# EAGLE design IO4-Codeline-Matrix (EAGLE 7.7.0)
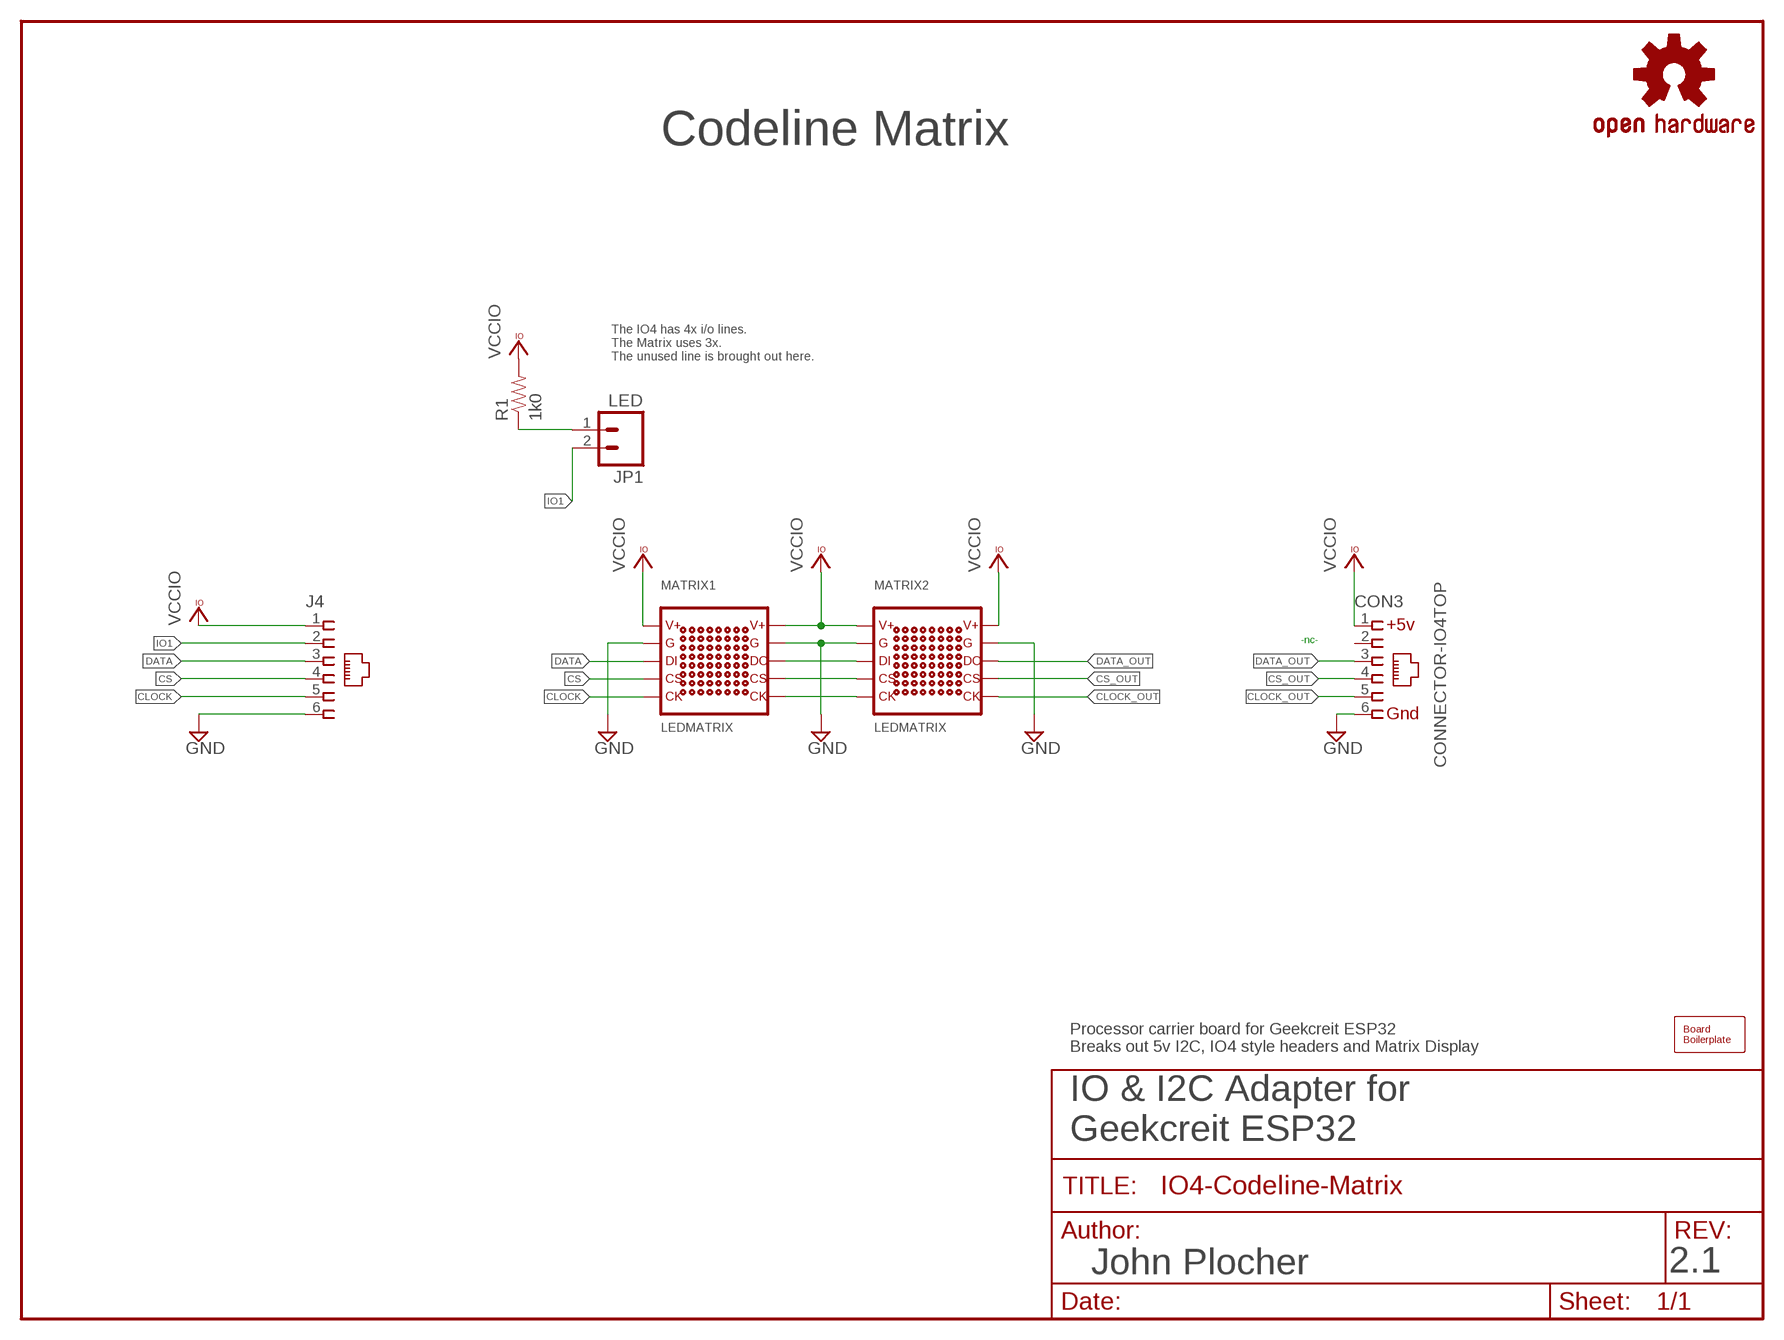
[diagram p0: schematic, sheet 1]

## Parts
BOARD  BOARD80X150  BOARD80X80  [BOARD-DINRAIL-3.17INX8CM]
CON3  CONNECTOR-IO4TOP  [RJ25-TOP]
J4  CONNECTOR-RJ25-43860-2-MOLEX  [RJ25-INVERTED]
JP1  LED  M02LOCK  [1X02_LOCK]
MATRIX1  LEDMATRIX  [LEDMATRIX]
MATRIX2  LEDMATRIX  [LEDMATRIX]
OSHW1  OSHW-LOGOL  [OSHW-LOGO-L]
R1  1k0  RPTH04  [AXIAL-0.4-RES]

## Nets
CLOCK [signals]: J4.5 MATRIX1.CLK@1(CLK)
CLOCK_OUT: CON3.5 MATRIX2.CLK@2(CLK)
CS [signals]: J4.4 MATRIX1.CS@1(CS)
CS_OUT: CON3.4 MATRIX2.CS@2(CS)
DATA [signals]: J4.3 MATRIX1.DI(DIN)
DATA_OUT: CON3.3 MATRIX2.DO(DOUT)
GND [signals]: CON3.6 J4.6 MATRIX1.G@1(G) MATRIX1.G@2(G) MATRIX2.G@1(G) MATRIX2.G@2(G)
IO1 [signals]: J4.2 JP1.2
N$1: JP1.1 R1.P$1
N$3: MATRIX1.DO(DOUT) MATRIX2.DI(DIN)
N$9: MATRIX1.CS@2(CS) MATRIX2.CS@1(CS)
N$10: MATRIX1.CLK@2(CLK) MATRIX2.CLK@1(CLK)
VCCIO [Power]: CON3.1 J4.1 MATRIX1.V+@1(V+) MATRIX1.V+@2(V+) MATRIX2.V+@1(V+) MATRIX2.V+@2(V+) R1.P$2
Unconnected: CON3.2

## Notes on the sheet
- Codeline Matrix
- The IO4 has 4x i/o lines.
  The Matrix uses 3x.
  The unused line is brought out here.
- -nc-
- Processor carrier board for Geekcreit ESP32
  Breaks out 5v I2C, IO4 style headers and Matrix Display
- IO & I2C Adapter for
  Geekcreit ESP32
- John Plocher | 2.1

## Library data of the parts
BOARD = SPCoast:BOARD
CON3 = SPCoast:CONNECTOR-IO4
J4 = SPCoast:CONNECTOR-RJ25: AMP connector
JP1 = SparkFun-Connectors:M02: Standard 2-pin 0.1" header. Use with - straight break away headers ( PRT-00116) - right angle break away headers (PRT-00553) - swiss pins (PRT-00743) - machine pins (PRT-00117) - female headers (PRT-00115) Molex polarized connector foot print use with: PRT-08233 with associated crimp pins and housings. 2.54_SCREWTERM for use with PRT-10571. 3.5mm Screw Terminal footprints for PRT-08084 5mm Screw Terminal footprints for use with PRT-08433
MATRIX1 MATRIX2 = SPCoast:LEDMATRIX: MAX7219 dot matrix module http://www.ebay.com/itm/10pcs-MAX7219-dot-matrix-module-Arduino-microcontroller-module-DIY-KIT-M67-/351218529526
OSHW1 = SparkFun:OSHW-LOGO: Open Source Hardware Logo This logo indicates the piece of hardware it is found on incorporates a OSHW license and/or adheres to the definition of open source hardware found here: http://freedomdefined.org/OSHW
R1 = SPCoast:R*: Resistor Basic schematic elements and footprints for 0603, 1206, and PTH 1/10th watt (small) resistors.

## Net classes
0 default: width 0.203 mm, drill 0.5 mm, clearance 0.203 mm
1 Power: width 0.406 mm, drill 0.8 mm, clearance 0.254 mm
2 signals: width 0.254 mm, drill 0.6 mm, clearance 0.254 mm
3 Feed: width 1.016 mm, drill 1.4 mm, clearance 0.254 mm

## Board
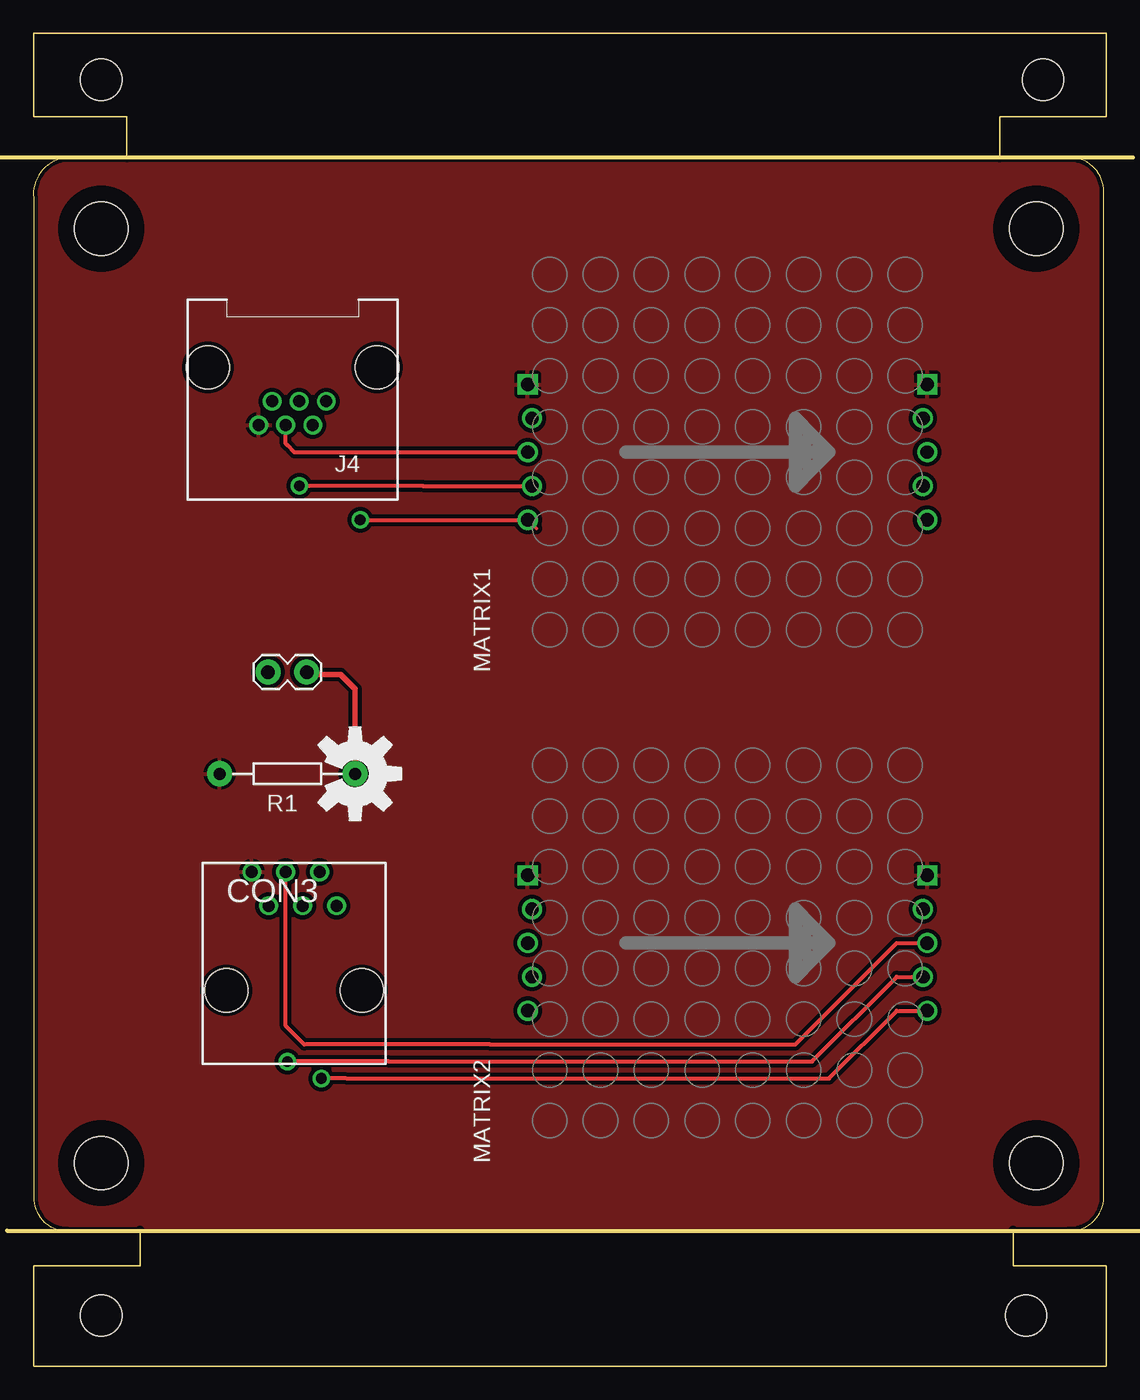
[diagram p1: board, top side]
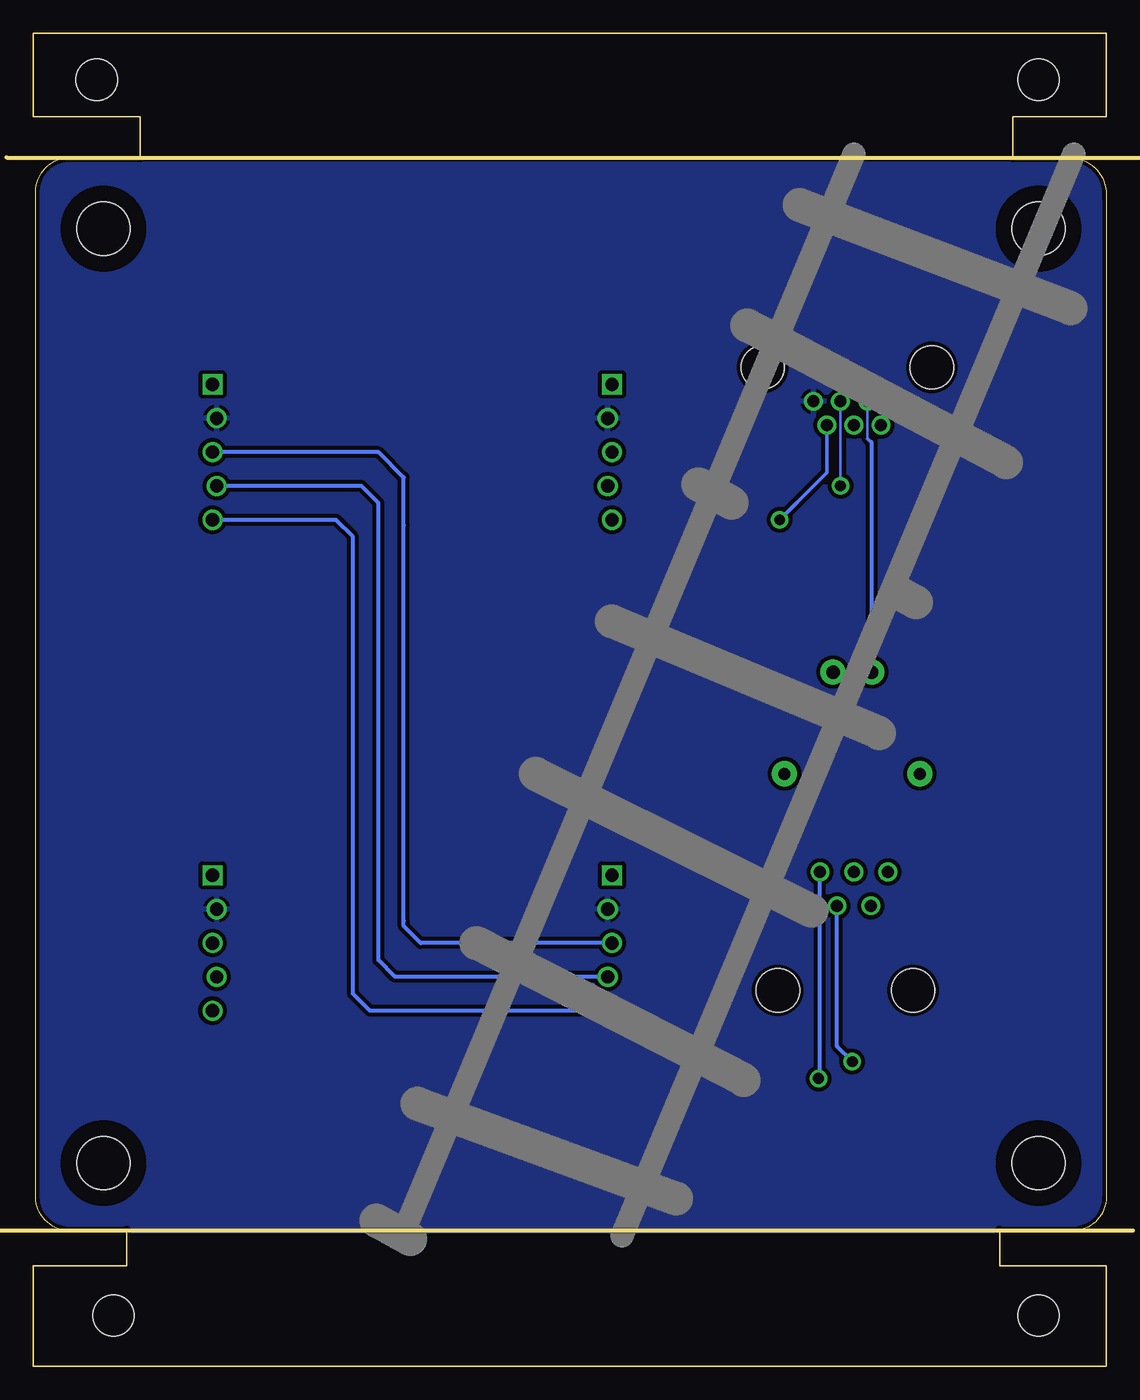
[diagram p2: board, bottom side, seen from below]

Size 80.51 x 100 mm. Coordinates in mm from the lower left corner, seen from the top.
Copper layers (1*16): Top 0.035mm / dielectric 1.5mm / Bottom 0.035mm
Design rules "Fusion_eagle_rule_v1.1 *": minimum track width 8mil, minimum drill 0.6mm, track to track 6mil, track to pad 6mil, pad to pad 10mil, via to via 10mil, smd to smd 10mil, copper to edge 10mil, drill to drill 10mil, minimum pad ring 10mil, minimum via ring 10mil, stop-mask expansion 2mil, vias tented up to drill 100mil, thermal gap 10mil

### Footprints (pad centres in the part's own frame; a part is rotated, then mirrored left to right if it is on the bottom)
BOARD-DINRAIL-3.17INX8CM = hole 4: 75.242,15.24; 5.08,85.344; 75.242,85.344; 5.08,15.24 | hole 3.1: 5.08,96.52; 75.75,96.52; 5.08,3.81; 74.48,3.81
RJ25-TOP = drill 0.9 pad 1.4: 1 -3.175,8.89; 2 -1.905,6.35; 3 -0.635,8.89; 4 0.635,6.35; 5 1.905,8.89; 6 3.175,6.35 | hole 3.251: -5.08,0; 5.08,0
RJ25-INVERTED = drill 0.9 pad 1.4: 1 2.54,4.318; 2 1.524,2.54; 3 0.508,4.318; 4 -0.508,2.54; 5 -1.524,4.318; 6 -2.54,2.54 | hole 3.251: -6.35,0; 6.35,0
1X02_LOCK = drill 1.016 pad 1.88: 1 -0.178,0; 2 2.718,0
LEDMATRIX = drill 1: CLK@1 -14.986,-5.08; CLK@2 14.986,-5.08; CS@1 -14.668,-2.54; CS@2 14.668,-2.54; DI -14.986,0; DO 14.986,0; G@1 -14.668,2.54; G@2 14.668,2.54 | drill 1 square: V+@1 -14.986,5.08; V+@2 14.986,5.08
AXIAL-0.4-RES = drill 0.9 pad 1.88: P$1 -5.08,0; P$2 5.08,0

### Placement (x,y rotation side)
BOARD  0.01,0 0 top
CON3  19.57,28.19 0 top
J4  19.44,74.93 180 top
JP1  20.33,52.07 180 top
MATRIX1  52.08,68.58 0 top
MATRIX2  52.08,31.75 0 top
OSHW1  24.14,44.45 270 top
R1  19.06,44.45 180 top

### Tracks (layer width: path | path; a pad name or v marks a point on that pad's centre or on a via)
CLOCK  (via drill 0.8)
  Top 0.254: 37.74,62.85 MATRIX1.CLK@1
  Top 0.305: v24.52,63.5 24.14,63.5 v24.52,63.5 | v24.52,63.5 MATRIX1.CLK@1
  Bottom 0.254: J4.5 20.97,67.06 23.25,64.77
  Bottom 0.305: v24.52,63.5 23.25,64.77
CLOCK_OUT  (via drill 0.8)
  Top 0.305: MATRIX2.CLK@2 64.78,26.67 59.7,21.59 23.51,21.59 v21.6,21.59
  Bottom 0.305: v21.6,21.59 21.48,21.72 CON3.5
CS  (via drill 0.8)
  Top 0.305: MATRIX1.CS@1 29.22,66.04 v19.95,66.04
  Bottom 0.203: J4.4 v19.95,66.04
CS_OUT  (via drill 0.8)
  Top 0.305: MATRIX2.CS@2 64.78,29.21 58.43,22.86 56.59,22.86 26.68,22.86 v19.06,22.86
  Bottom 0.305: v19.06,22.86 20.21,24 CON3.4
DATA
  Top 0.305: MATRIX1.DI 35.57,68.58 19.57,68.58 19.06,69.09 18.94,69.22 J4.3
DATA_OUT
  Top 0.305: MATRIX2.DO 64.78,31.75 57.16,24.13 55.64,24.13 34.3,24.13 20.33,24.13 19.06,25.4 18.94,25.53 CON3.3
GND
  pour Bottom (isolate 0.305, rank 2): 80.02,10.16 80.02,90.17 0.01,90.17 0.01,10.16
IO1
  Bottom 0.203: J4.2 17.92,69.6
  Bottom 0.254: 17.92,69.6 17.67,69.34
  Bottom 0.305: 17.67,69.34 17.62,69.29 JP1.2
N$1
  Top 0.254: JP1.1 20.33,51.89
  Top 0.406: 20.33,51.89 23.05,51.89 24.14,50.8 R1.P$1
N$3
  Bottom 0.305: MATRIX2.DI 51.45,31.75 52.72,33.02 52.72,33.41 52.72,63.11 52.72,66.67 54.62,68.58 MATRIX1.DO
N$9
  Bottom 0.305: MATRIX2.CS@1 53.35,29.21 54.62,30.48 54.62,32.78 54.62,62.47 54.62,64.77 55.89,66.04 MATRIX1.CS@2
N$10
  Bottom 0.305: MATRIX2.CLK@1 55.26,26.67 56.53,27.94 56.53,32.14 56.53,61.83 56.53,62.23 57.8,63.5 MATRIX1.CLK@2
VCCIO
  pour Top (isolate 0.305, rank 2): 80.02,10.16 80.02,90.17 0.01,90.17 0.01,10.16

### Text on the board
tDocu: v1.0 | bit | 0 1 2 3 4 5 6 7 | 5V I/O | 0 1 2 3 4 5 6 7 | Display Board | Codeline | 5V | GND | byte | Data | CS | Clock | IO1 | Data | CS | CLK | 5v | Gnd | IO1 / / LED | - | + | John Plocher | Open Source | Hardware | Controls | 2018.07 | 0 1 2 3 4 5 6 7 | byte | (optional) | Daisy Chain / additional / display boards | Indications
bDocu: Made in the PCR, Coast Division, NMRA | Codeline Display | Go Bears! | IO4 Codeline Matrix | Model Railroading is fun! | www. SP Coast .com